# Altium schematic sheet FingerPrint_TS.SchDoc
size A
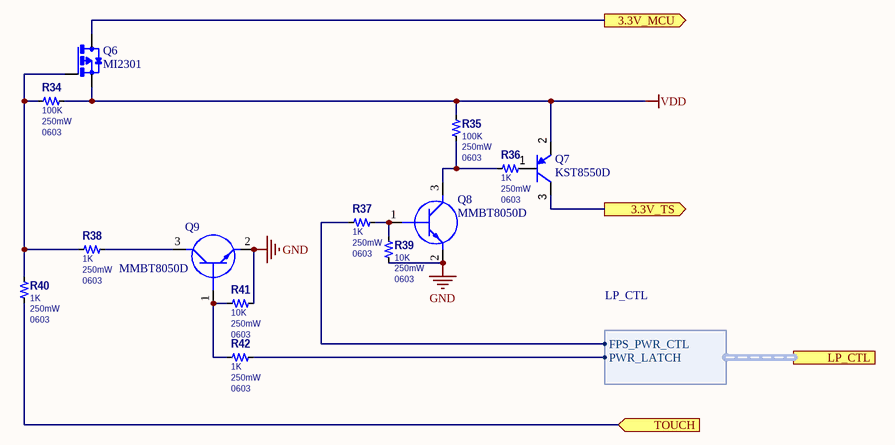
[diagram p0: FingerPrint_TS.SchDoc]

## Parts
Q6  MI2301  [SOT23]
Q7  KST8550D  [SOT23]
Q8  MMBT8050D  [SOT23]
Q9  MMBT8050D  [SOT23]
R34  100K  Power Rating: 250mW  Case/Package: 0603  [0603-R]
R35  100K  Power Rating: 250mW  Case/Package: 0603  [0603-R]
R36  1K  Power Rating: 250mW  Case/Package: 0603  [0603-R]
R37  1K  Power Rating: 250mW  Case/Package: 0603  [0603-R]
R38  1K  Power Rating: 250mW  Case/Package: 0603  [0603-R]
R39  10K  Power Rating: 250mW  Case/Package: 0603  [0603-R]
R40  1K  Power Rating: 250mW  Case/Package: 0603  [0603-R]
R41  10K  Power Rating: 250mW  Case/Package: 0603  [0603-R]
R42  1K  Power Rating: 250mW  Case/Package: 0603  [0603-R]

## Ports
3.3V_MCU (out), 3.3V_TS (out), LP_CTL (harness LP_CTL), TOUCH (in)

## Harnesses
LP_CTL: PWR_LATCH, FPS_PWR_CTL

## Nets
GND: Q8.2(E) Q9.2(E) R39.1 R41.2
VDD: Q6.2(S) Q7.2(Emitter) R34.1 R35.2
3.3V_MCU: Q6.3(D) ; port 3.3V_MCU
3.3V_TS: Q7.3(Collector) ; port 3.3V_TS
TOUCH: R40.1 ; port TOUCH
NetQ6_1: Q6.1(G) R34.2 R38.1 R40.2
NetQ7_1: Q7.1(Base) R36.2
NetQ8_1: Q8.1(B) R37.2 R39.2
NetQ8_3: Q8.3(C) R35.1 R36.1
NetQ9_1: Q9.1(B) R41.1 R42.2
NetQ9_3: Q9.3(C) R38.2
NetR37_1: R37.1 ; port LP_CTL.FPS_PWR_CTL
NetR42_1: R42.1 ; port LP_CTL.PWR_LATCH

## Library data of the parts
Q7 = KST8550D: Trans GP BJT PNP 45V 0.5A 350mW Automotive 3-Pin SOT-23 T/R; Manufacturer: Diodes; Max Power Dissipation: 310mW; Max Collector Current: 500mA; Number of Elements: 1; Frequency: 100MHz; Emitter Base Voltage (VEBO): 5V; Collector Emitter Saturation Voltage: -700mV; Element Configuration: Single; Collector-emitter Voltage-Max: 700mV; Supplier 1: Digi-Key; Manufacturer Part Number: KST8550D; RoHS: Yes; Category: BJTs; Stock 1: 1770; Pricing 1: 1=0.37000, 10=0.30000, 100=0.15890, 500=0.10454, 1000=0.07109 (USD); Mount: Surface Mount; Case/Package: SOT-23; Number of Pins: 3; Weight: 0.000282oz; Contact Plating: Tin,Matte; Min Operating Temperature: -65°C; Max Operating Temperature: 150°C; Collector Emitter Voltage (VCEO): 45V; Packaging: Tape and Reel; Collector Emitter Breakdown Voltage: 45V; Polarity: PNP; Package Quantity: 3000; Transition Frequency: 100MHz; Max Breakdown Voltage: 45V; Power Dissipation: 310mW; Gain Bandwidth Product: 100MHz; Series: -; Length: 3.05mm; Width: 1.4mm; Height: 1mm; REACH SVHC: No SVHC; RoHS Compliant: Yes; Lead Free: Lead Free; ComponentLink1URL: https://datasheet.lcsc.com/lcsc/1912111437_KEXIN-KST8550D_C382284.pdf; ComponentLink1Description: https://datasheet.ciiva.com/6360/ds11208-6360807.pdf?src-supplier=Digi-Key; ComponentLink2URL: https://datasheet.lcsc.com/lcsc/1912111437_KEXIN-KST8550D_C382284.pdf; ComponentLink2Description: https://datasheet.ciiva.com/16614/ds11208-16614428.pdf?src-supplier=Avnet+Europe; Supplier Part Number 1: BC807-25FDICT-ND
Q8 Q9 = MMBT8050D: Transistor BJT NPN; Manufacturer_Name: Comchip Technology; Datasheet Link: https://datasheet.lcsc.com/lcsc/1912111437_PJSEMI-MMBT8050D_C411762.pdf; Height: 1.15mm; Manufacturer_Part_Number: MMBT8050; Mouser Part Number: MMBT8050; Arrow Part Number: MMBT8050
R34-R42 = Res: Manufacturer: Panasonic; Manufacturer Part Number: ERJ-8GEYJ621V; Resistance: 620R; Tolerance: 5%; Voltage Rating: 200V; Temperature Coefficient: 200ppm/°C; ComponentLink1URL: https://datasheet.ciiva.com/15193/getdatasheetpartid-366470-15193725.pdf?src-supplier=Verical; ComponentLink1Description: Datasheet; Supplier 1: Avnet; Stock 1: 6255; Pricing 1: 1 = 0.01200 (USD); RoHS: Yes; Mount: Surface Mount; Case Code (Metric): 3216; Case Code (Imperial): 1206; Contact Plating: Tin; Min Operating Temperature: -55°C; Max Operating Temperature: 155°C; Packaging: Tape and Reel; Package Quantity: 1; Resistor Type: Thick Film; Number of Terminations: 2; Max Power Dissipation: 250mW; Voltage Rating (DC): 200V; Features: Automotive AEC-Q200; Series: ERJ; Construction: Rectangular; Resistance Tolerance: 5%; Length: 3.2mm; Width: 0.063inch; Height: 0.028inch; Depth: 1.6mm; Radiation Hardening: No; REACH SVHC: No SVHC; Military Standard: Not; Lead Free: Lead Free; RoHS Compliant: Yes; ComponentLink2URL: https://datasheet.ciiva.com/46387/1500035-46387094.pdf?src-supplier=Element14; ComponentLink2Description: https://datasheet.ciiva.com/46387/1500035-46387094.pdf?src-supplier=Element14; ComponentLink3URL: https://datasheet.ciiva.com/5915/1500035-5915369.pdf?src-supplier=Farnell; ComponentLink3Description: https://datasheet.ciiva.com/5915/1500035-5915369.pdf?src-supplier=Farnell; ComponentLink4URL: https://datasheet.ciiva.com/28677/1678796-28677018.pdf?src-supplier=Element14; ComponentLink4Description: https://datasheet.ciiva.com/28677/1678796-28677018.pdf?src-supplier=Element14; ComponentLink5URL: https://datasheet.ciiva.com/17204/aoa0000ce1-17204972.pdf?src-supplier=Avnet+Europe; ComponentLink5Description: https://datasheet.ciiva.com/17204/aoa0000ce1-17204972.pdf?src-supplier=Avnet+Europe; ComponentLink6URL: https://datasheet.ciiva.com/16515/aoa0000ce1-16515933.pdf?src-supplier=Avnet+Asia; ComponentLink6Description: https://datasheet.ciiva.com/16515/aoa0000ce1-16515933.pdf?src-supplier=Avnet+Asia; Supplier Part Number 1: 65T8955
Q6 = MI2301: Datasheet: http://www.szjuquan.com/upload_files/qb_sell_/pdf/MI2301.pdf; Availability: Unavailable; Price: None; MP: MI2301; Value: *